# EAGLE design sumppitnodeboard (EAGLE 9.1.3)
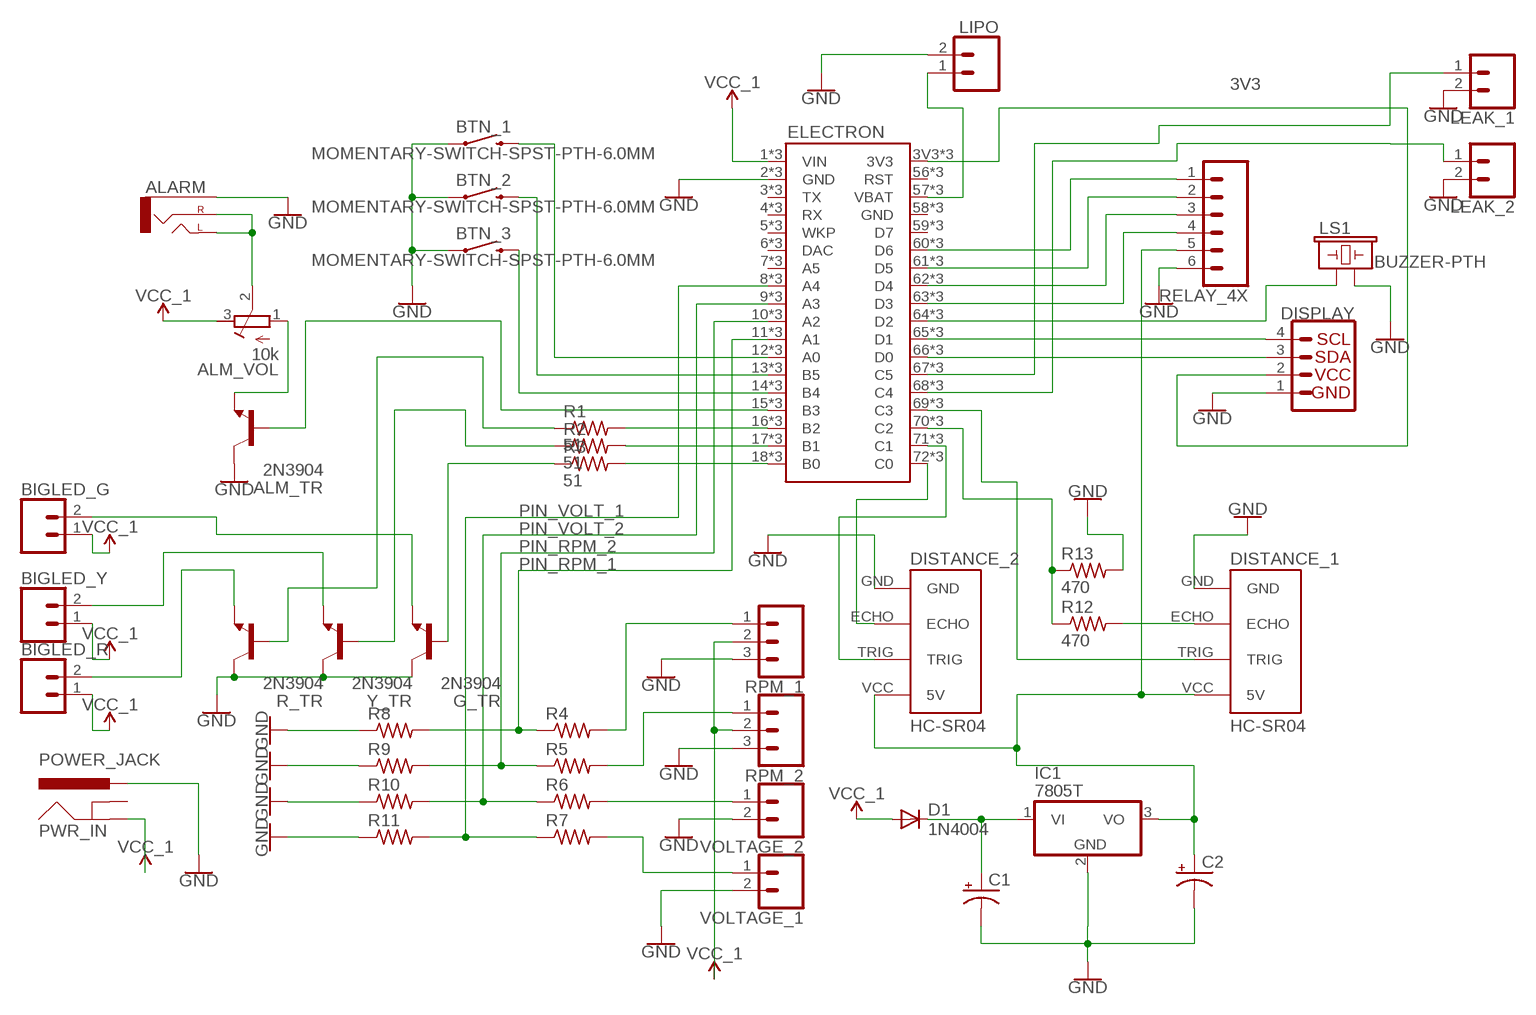
[diagram p0: schematic, sheet 1]

## Parts
ALARM  AUDIO_JACK_2.5MM_2.5MM  [STEREOJACK2.5MM_STEREOJACK2.5MM]
ALM_TR  2N3904  [TO92]
ALM_VOL  10k  R-TRIMM64W  [RTRIM64W]
BIGLED_G  CONN_02  [1X02]
BIGLED_R  CONN_02  [1X02]
BIGLED_Y  CONN_02  [1X02]
BTN_1  MOMENTARY-SWITCH-SPST-PTH-6.0MM  [TACTILE_SWITCH_PTH_6.0MM]
BTN_2  MOMENTARY-SWITCH-SPST-PTH-6.0MM  [TACTILE_SWITCH_PTH_6.0MM]
BTN_3  MOMENTARY-SWITCH-SPST-PTH-6.0MM  [TACTILE_SWITCH_PTH_6.0MM]
C1  CPOL-USE1.8-4  [E1,8-4]
C2  CPOL-USE1.8-4  [E1,8-4]
D1  1N4004  [DO41-10]
DISPLAY  I2C_STANDARD  [1X04]
DISTANCE_1  HC-SR04  [HC-SR04_FOOTPRINT]
DISTANCE_2  HC-SR04  [HC-SR04_FOOTPRINT]
ELECTRON  ELECTRONDUALROW  [ELECTRON_DUAL-ROW]
G_TR  2N3904  [TO92]
IC1  7805T  [TO220H]
LEAK_1  CONN_02  [1X02]
LEAK_2  CONN_02  [1X02]
LIPO  CONN_02JST-PTH-2  [JST-2-PTH]
LS1  BUZZER-PTH  [BUZZER-12MM]
PWR_IN  POWER_JACK  [POWER_JACK_PTH]
R1  51  R-US_0204/5  [0204/5]
R2  51  R-US_0204/5  [0204/5]
R3  51  R-US_0204/5  [0204/5]
R4  R-US_0204/5  [0204/5]
R5  R-US_0204/5  [0204/5]
R6  R-US_0204/5  [0204/5]
R7  R-US_0204/5  [0204/5]
R8  R-US_0204/5  [0204/5]
R9  R-US_0204/5  [0204/5]
R10  R-US_0204/5  [0204/5]
R11  R-US_0204/5  [0204/5]
R12  470  R-US_0204/5  [0204/5]
R13  470  R-US_0204/5  [0204/5]
R_TR  2N3904  [TO92]
RELAY_4X  CONN_06LOCK  [1X06_LOCK]
RPM_1  CONN_03  [1X03]
RPM_2  CONN_03  [1X03]
VOLTAGE_1  CONN_02  [1X02]
VOLTAGE_2  CONN_02  [1X02]
Y_TR  2N3904  [TO92]

## Nets
3V3: DISPLAY.2 ELECTRON.3V3 ELECTRON.55(3V3) ELECTRON.91(3V3)
GND: ALARM.RING1(SLEEVE) ALM_TR.1(C) BTN_1.1 BTN_2.1 BTN_3.1 C1.- C2.- DISPLAY.1 DISTANCE_1.GND DISTANCE_2.GND ELECTRON.2(GND) ELECTRON.38(GND) ELECTRON.GND@2(GND) G_TR.1(C) IC1.2(GND) LEAK_1.2 LEAK_2.2 LIPO.2 LS1.- PWR_IN.PWR R8.1 R9.1 R10.1 R11.1 R13.2 R_TR.1(C) RELAY_4X.6 RPM_1.3 RPM_2.3 VOLTAGE_1.2 VOLTAGE_2.2 Y_TR.1(C)
N$1: ALARM.SHIELD(LEFT) ALARM.TIP(RIGHT) ALM_VOL.2(S)
N$2: ALM_TR.3(E) ALM_VOL.1(A)
N$3: ALM_TR.2(B) ELECTRON.15(B3) ELECTRON.51(B3) ELECTRON.B3
N$4: R1.1 R_TR.2(B)
N$5: ELECTRON.17(B1) ELECTRON.53(B1) ELECTRON.B1 R2.2
N$6: ELECTRON.18(B0) ELECTRON.54(B0) ELECTRON.B0 R3.2
N$7: BTN_3.3 ELECTRON.14(B4) ELECTRON.50(B4) ELECTRON.B4
N$8: ELECTRON.57(VBAT) ELECTRON.93(VBAT) ELECTRON.VBAT LIPO.1
N$9: BTN_2.3 ELECTRON.13(B5) ELECTRON.49(B5) ELECTRON.B5
N$10: BTN_1.3 ELECTRON.12(A0) ELECTRON.48(A0) ELECTRON.A0
N$11: DISPLAY.3 ELECTRON.66(D0) ELECTRON.102(D0) ELECTRON.D0
N$12: DISPLAY.4 ELECTRON.65(D1) ELECTRON.101(D1) ELECTRON.D1
N$13: BIGLED_G.2 G_TR.3(E)
N$14: DISTANCE_1.ECHO R12.2
N$15: DISTANCE_2.ECHO ELECTRON.72(C0) ELECTRON.108(C0) ELECTRON.C0
N$16: DISTANCE_2.TRIG ELECTRON.71(C1) ELECTRON.107(C1) ELECTRON.C1
N$17: DISTANCE_1.TRIG ELECTRON.69(C3) ELECTRON.105(C3) ELECTRON.C3
N$18: C1.+ D1.C IC1.1(VI)
N$19: ELECTRON.16(B2) ELECTRON.52(B2) ELECTRON.B2 R1.2
N$20: R2.1 Y_TR.2(B)
N$21: G_TR.2(B) R3.1
N$22: ELECTRON.64(D2) ELECTRON.100(D2) ELECTRON.D2 LS1.+
N$23: ELECTRON.67(C5) ELECTRON.103(C5) ELECTRON.C5 LEAK_1.1
N$24: R6.2 VOLTAGE_2.1
N$25: R5.2 RPM_2.1
N$26: R4.2 RPM_1.1
N$27: R7.2 VOLTAGE_1.1
N$28: ELECTRON.70(C2) ELECTRON.106(C2) ELECTRON.C2 R12.1 R13.1
N$29: BIGLED_Y.2 Y_TR.3(E)
N$30: BIGLED_R.2 R_TR.3(E)
N$32: ELECTRON.68(C4) ELECTRON.104(C4) ELECTRON.C4 LEAK_2.1
N$33: C2.+ DISTANCE_1.VCC(5V) DISTANCE_2.VCC(5V) IC1.3(VO) RELAY_4X.5
N$34: ELECTRON.63(D3) ELECTRON.99(D3) ELECTRON.D3 RELAY_4X.4
N$35: ELECTRON.62(D4) ELECTRON.98(D4) ELECTRON.D4 RELAY_4X.3
N$36: ELECTRON.61(D5) ELECTRON.97(D5) ELECTRON.D5 RELAY_4X.2
N$37: ELECTRON.60(D6) ELECTRON.96(D6) ELECTRON.D6 RELAY_4X.1
PIN_RPM_1: ELECTRON.11(A1) ELECTRON.47(A1) ELECTRON.A1 R4.1 R8.2
PIN_RPM_2: ELECTRON.10(A2) ELECTRON.46(A2) ELECTRON.A2 R5.1 R9.2
PIN_VOLT_1: ELECTRON.8(A4) ELECTRON.44(A4) ELECTRON.A4 R7.1 R11.2
PIN_VOLT_2: ELECTRON.9(A3) ELECTRON.45(A3) ELECTRON.A3 R6.1 R10.2
VCC_1: ALM_VOL.3(E) BIGLED_G.1 BIGLED_R.1 BIGLED_Y.1 D1.A ELECTRON.1(VIN) ELECTRON.37(VIN) ELECTRON.VIN PWR_IN.GND RPM_1.2 RPM_2.2
Unconnected: ELECTRON.3(TX) ELECTRON.4(RX) ELECTRON.5(WKP) ELECTRON.6(DAC) ELECTRON.7(A5) ELECTRON.39(TX) ELECTRON.40(RX) ELECTRON.41(WKP) ELECTRON.42(DAC) ELECTRON.43(A5) ELECTRON.56(RST) ELECTRON.59(D7) ELECTRON.92(RST) ELECTRON.95(D7) ELECTRON.A5 ELECTRON.D7 ELECTRON.DAC ELECTRON.RST ELECTRON.RX ELECTRON.TX ELECTRON.WKP PWR_IN.GNDBREAK

## Power pins joined to a net without a drawn wire
GND: ELECTRON.58(GND) ELECTRON.94(GND) ELECTRON.GND

## Library data of the parts
ALARM = SparkFun-Connectors:AUDIO_JACK_2.5MM: Audio Jack 2.5mm variants of PTH and SMT audio jacks. SparkFun Products: SparkFun PicoBoard <https://www.sparkfun.com/products/11888>- 2.5mm SMD; PROD_ID: CONN-09878
ALM_TR G_TR R_TR Y_TR = transistor:2N3904: NPN TRANSISTOR
ALM_VOL = rcl:R-TRIMM: Trimm resistor; SPICEMODEL: X; SPICEPREFIXL: POT
BIGLED_G BIGLED_R BIGLED_Y LEAK_1 LEAK_2 VOLTAGE_1 VOLTAGE_2 = SparkFun-Connectors:CONN_02: Multi connection point. Often used as Generic Header-pin footprint for 0.1 inch spaced/style header connections On any of the 0.1 inch spaced packages, you can populate with these: Break Away Headers - Straight <https://www.sparkfun.com/products/116> (PRT-00116) Break Away Male Headers - Right Angle <https://www.sparkfun.com/products/553> (PRT-00553) Female Headers <https://www.sparkfun.com/products/115> (PRT-00115) Break Away Headers - Machine Pin <https://www.sparkfun.com/products/117> (PRT-00117) Break Away Female Headers - Swiss Machine Pin <https://www.sparkfun.com/products/743> (PRT-00743) For SCREWTERMINALS and SPRING TERMINALS visit here: Screw Terimnals on SparkFun.com <https://www.sparkfun.com/search/results?term=Screw+Terminals> (5mm/3.5mm/2.54mm spacing) This device is also useful as a general connection point to wire up your design to another part of your project. Our various solder wires solder well into these plated through hole pads. Hook-Up Wire - Assortment (Stranded, 22 AWG) <https://www.sparkfun.com/products/11375> (PRT-11375) Hook-Up Wire - Assortment (Solid Core, 22 AWG) <https://www.sparkfun.com/products/11367> (PRT-11367) View the entire wire category on our website here <https://www.sparkfun.com/categories/141> Special notes: Molex polarized connector foot print use with: PRT-08233 with associated crimp pins and housings. 2.54_SCREWTERM for use with PRT-10571. 3.5mm Screw Terminal footprints for PRT-08084 5mm Screw Terminal footprints for use with PRT-08432
BTN_1-BTN_3 = SparkFun-Switches:MOMENTARY-SWITCH-SPST: Momentary Switch (Pushbutton) - SPST Normally-open (NO) SPST momentary switches (buttons, pushbuttons). Variants PTH-12MM - 12mm square, through-hole Momentary Pushbutton Switch - 12mm Square <https://www.sparkfun.com/products/9190> (COM-09190) PTH-6.0MM, PTH-6.0MM-KIT - 6.0mm square, through-hole Mini Pushbutton Switch <https://www.sparkfun.com/products/97> (COM-00097) KIT package intended for soldering kit's - only one side of pads' copper is exposed. PTH-RIGHT-ANGLE-KIT - Right-angle, through-hole Right Angle Tactile Button <https://www.sparkfun.com/products/10791> - Used on SparkFun BigTime Watch Kit <https://www.sparkfun.com/products/11734> SMD-12MM - 12mm square, surface-mount Tactile Button - SMD (12mm) <https://www.sparkfun.com/products/12993> (COM-12993) Used on SparkFun PicoBoard <https://www.sparkfun.com/products/11888> SMD-4.5MM - 4.5mm Square Trackball Switch Used on SparkFun Blackberry Trackballer Breakout <https://www.sparkfun.com/products/13169> SMD-4.6MMX2.8MM - 4.60mm x 2.80mm, surface mount Used on SparkFun SAMD21 Mini Breakout <https://www.sparkfun.com/products/13664> SMD-5.2MM, SMD-5.2-REDUNDANT - 5.2mm square, surface-mount Mini Pushbutton Switch - SMD <https://www.sparkfun.com/products/8720> (COM-08720) Used on Arduino Pro Mini <https://www.sparkfun.com/products/11114> REDUNDANT package connects both switch circuits together SMD-6.0X3.5MM - 6.0 x 3.5mm, surface mount Momentary Reset Switch SMD <https://www.sparkfun.com/products/8229> (COM-08229) SMD-6.2MM-TALL - 6.2mm square, surface mount Tactile Button - SMD (6mm) <https://www.sparkfun.com/products/12992> Used on SparkFun Digital Sandbox <https://www.sparkfun.com/products/12651> SMD-RIGHT-ANGLE - Right-angle, surface mount Used on SparkFun Block for Intel® Edison - Arduino <https://www.sparkfun.com/products/13036>; PROD_ID: SWCH-08441; SF_SKU: COM-00097
C1 C2 = rcl:CPOL-US: POLARIZED CAPACITOR, American symbol; SPICEPREFIX: C
D1 = diode:1N4004: DIODE general purpose rectifier, 1 A
DISPLAY = SparkFun-Connectors:I2C_STANDARD: SparkFun I2C Standard Pinout Header SparkFun has standardized on a pinout for all I2C based sensor breakouts. This pinout allows I2C boards to be plugged directly into the headers on Arduino Uno compatible boards, and to be daisy chained easily. Example SparkFun Products: SparkFun Atmospheric Sensor Breakout - BME280 <https://www.sparkfun.com/products/13676> SparkFun Altitude/Pressure Sensor Breakout - MPL3115A2 <https://www.sparkfun.com/products/11084> SparkFun TOF Range Finder Sensor - VL6180 <https://www.sparkfun.com/products/12785>
DISTANCE_1 DISTANCE_2 = Ultrasonic Sensor HC-SR04:HC-SR04: Ultrasonic Sensor HC-SR04
ELECTRON = Particle:ELECTRON
IC1 = linear:78*: Positive VOLTAGE REGULATOR Source: http://cache.national.com/ds/LM/LM78L05.pdf http://www.fairchildsemi.com/ds/LM/LM7805.pdf
LIPO = SparkFun-Connectors:CONN_02: Multi connection point. Often used as Generic Header-pin footprint for 0.1 inch spaced/style header connections On any of the 0.1 inch spaced packages, you can populate with these: Break Away Headers - Straight <https://www.sparkfun.com/products/116> (PRT-00116) Break Away Male Headers - Right Angle <https://www.sparkfun.com/products/553> (PRT-00553) Female Headers <https://www.sparkfun.com/products/115> (PRT-00115) Break Away Headers - Machine Pin <https://www.sparkfun.com/products/117> (PRT-00117) Break Away Female Headers - Swiss Machine Pin <https://www.sparkfun.com/products/743> (PRT-00743) For SCREWTERMINALS and SPRING TERMINALS visit here: Screw Terimnals on SparkFun.com <https://www.sparkfun.com/search/results?term=Screw+Terminals> (5mm/3.5mm/2.54mm spacing) This device is also useful as a general connection point to wire up your design to another part of your project. Our various solder wires solder well into these plated through hole pads. Hook-Up Wire - Assortment (Stranded, 22 AWG) <https://www.sparkfun.com/products/11375> (PRT-11375) Hook-Up Wire - Assortment (Solid Core, 22 AWG) <https://www.sparkfun.com/products/11367> (PRT-11367) View the entire wire category on our website here <https://www.sparkfun.com/categories/141> Special notes: Molex polarized connector foot print use with: PRT-08233 with associated crimp pins and housings. 2.54_SCREWTERM for use with PRT-10571. 3.5mm Screw Terminal footprints for PRT-08084 5mm Screw Terminal footprints for use with PRT-08432; PROD_ID: CONN-09863; SKU: PRT-09914
LS1 = SparkFun-Electromechanical:BUZZER: Buzzer Small round buzzers that operate around the audible 2kHz range. You can use these as speakers to create simple music or user interfaces. Variant Overview: PTH - Mini Speaker - PC Mount 12mm 2.048kHz <https://www.sparkfun.com/products/7950> PTH_KIT - Mini Speaker - PC Mount 12mm 2.048kHz <https://www.sparkfun.com/products/7950> KIT simplifies soldering by adding stop mask to one side of the pads. PTH_NO_SILK - Mini Speaker - PC Mount 12mm 2.048kHz <https://www.sparkfun.com/products/7950> No silkscreen indicator of buzzer outline. PTH_KIT_NO_SILK - Mini Speaker - PC Mount 12mm 2.048kHz <https://www.sparkfun.com/products/7950> KIT package w/o silkscreen SMD - Buzzer Audio Magnetic (CCV-084B16) SMD buzzer used on, e.g. the LilyPad Buzzer <https://www.sparkfun.com/products/8463> and RFID USB Reader <https://www.sparkfun.com/products/9963>. SMD_KIT - Buzzer Audio Magnetic (CCV-084B16) SMD Buzzer with elongated pins to make soldering easier. Used on the SparkFun Simon Says - Surface Mount Soldering Kit <https://www.sparkfun.com/products/10935>.; PROD_ID: COMP-08253; SF_SKU: COM-07950
PWR_IN = SparkFun-Connectors:POWER_JACK: Power Jack Connector This is the standard 5.5mm barrel jack for power. The PTH is the most common, proven, reliable, footprint. The Slot footprint only works if the mill layer is transmitted to the PCB fab house so be warned. Here are the connectors we sell at SparkFun: DC Barrel Power Jack/Connector <https://www.sparkfun.com/products/119> (PRT-00119) DC Barrel Power Jack/Connector (SMD) <https://www.sparkfun.com/products/12748> (PRT-12748) DC Barrel Jack Adapter - Breadboard Compatible <https://www.sparkfun.com/products/10811> (PRT-10811) It is used on this SparkFun product (and many, many others): SparkFun RedBoard - Programmed with Arduino <https://www.sparkfun.com/products/12757> (DEV-12757) Also, if you need a mating power supply or connector, please check these out: Wall Adapter Power Supply - 9VDC 650mA <https://www.sparkfun.com/products/298> (TOL-00298) DC Barrel Jack Adapter - Male <https://www.sparkfun.com/products/10287> (PRT-10287); PROD_ID: CONN-08197
R1-R13 = resistor:R-US_: RESISTOR, American symbol
RELAY_4X = SparkFun-Connectors:CONN_06: Multi connection point. Often used as Generic Header-pin footprint for 0.1 inch spaced/style header connections On any of the 0.1 inch spaced packages, you can populate with these: Break Away Headers - Straight <https://www.sparkfun.com/products/116> (PRT-00116) Break Away Male Headers - Right Angle <https://www.sparkfun.com/products/553> (PRT-00553) Female Headers <https://www.sparkfun.com/products/115> (PRT-00115) Break Away Headers - Machine Pin <https://www.sparkfun.com/products/117> (PRT-00117) Break Away Female Headers - Swiss Machine Pin <https://www.sparkfun.com/products/743> (PRT-00743) Arduino Stackable Header - 6 Pin <https://www.sparkfun.com/products/9280> (PRT-09280) For SCREWTERMINALS and SPRING TERMINALS visit here: Screw Terimnals on SparkFun.com <https://www.sparkfun.com/search/results?term=Screw+Terminals> (5mm/3.5mm/2.54mm spacing) This device is also useful as a general connection point to wire up your design to another part of your project. Our various solder wires solder well into these plated through hole pads. Hook-Up Wire - Assortment (Stranded, 22 AWG) <https://www.sparkfun.com/products/11375> (PRT-11375) Hook-Up Wire - Assortment (Solid Core, 22 AWG) <https://www.sparkfun.com/products/11367> (PRT-11367) View the entire wire category on our website here <https://www.sparkfun.com/categories/141>
RPM_1 RPM_2 = SparkFun-Connectors:CONN_03: Multi connection point. Often used as Generic Header-pin footprint for 0.1 inch spaced/style header connections On any of the 0.1 inch spaced packages, you can populate with these: Break Away Headers - Straight <https://www.sparkfun.com/products/116> (PRT-00116) Break Away Male Headers - Right Angle <https://www.sparkfun.com/products/553> (PRT-00553) Female Headers <https://www.sparkfun.com/products/115> (PRT-00115) Break Away Headers - Machine Pin <https://www.sparkfun.com/products/117> (PRT-00117) Break Away Female Headers - Swiss Machine Pin <https://www.sparkfun.com/products/743> (PRT-00743) Stackable Header - 3 Pin (Female, 0.1") <https://www.sparkfun.com/products/13875> (PRT-13875) For SCREWTERMINALS and SPRING TERMINALS visit here: Screw Terimnals on SparkFun.com <https://www.sparkfun.com/search/results?term=Screw+Terminals> (5mm/3.5mm/2.54mm spacing) This device is also useful as a general connection point to wire up your design to another part of your project. Our various solder wires solder well into these plated through hole pads. Hook-Up Wire - Assortment (Stranded, 22 AWG) <https://www.sparkfun.com/products/11375> (PRT-11375) Hook-Up Wire - Assortment (Solid Core, 22 AWG) <https://www.sparkfun.com/products/11367> (PRT-11367) View the entire wire category on our website here <https://www.sparkfun.com/categories/141> Special notes: Molex polarized connector foot print use with SKU : PRT-08232 with associated crimp pins and housings.

## Board
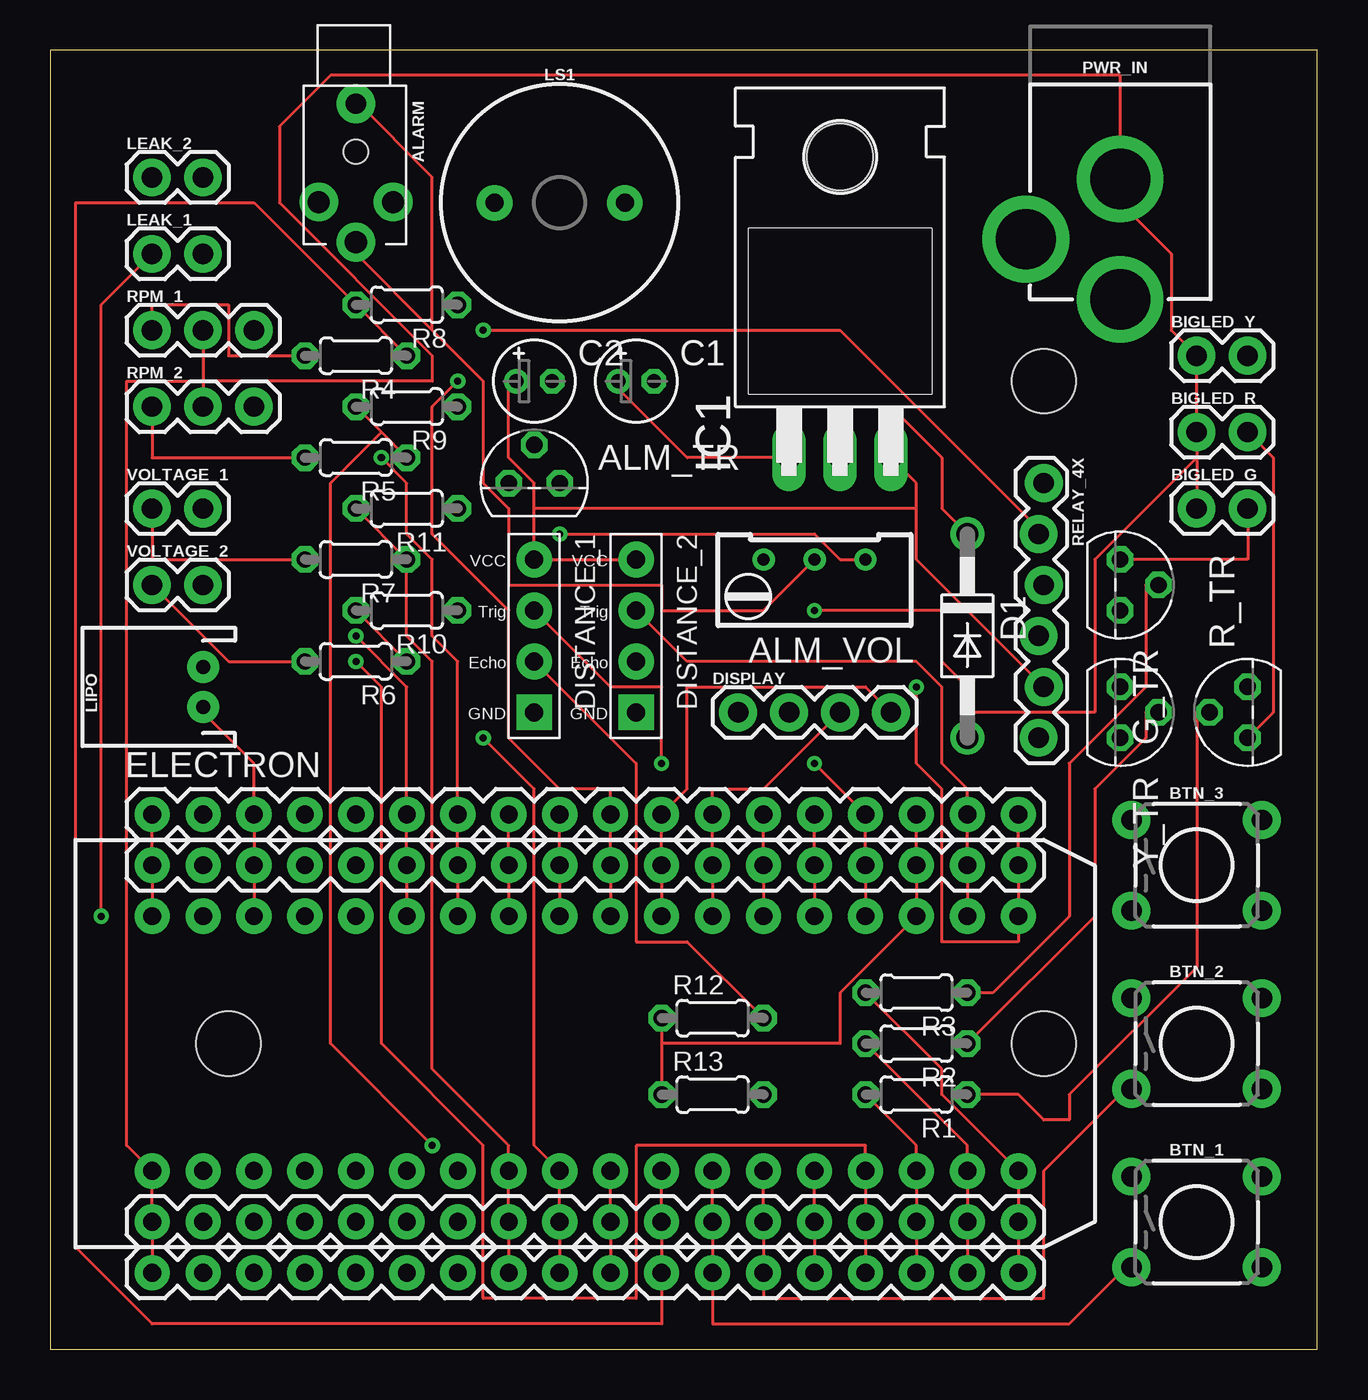
[diagram p1: board, top side]
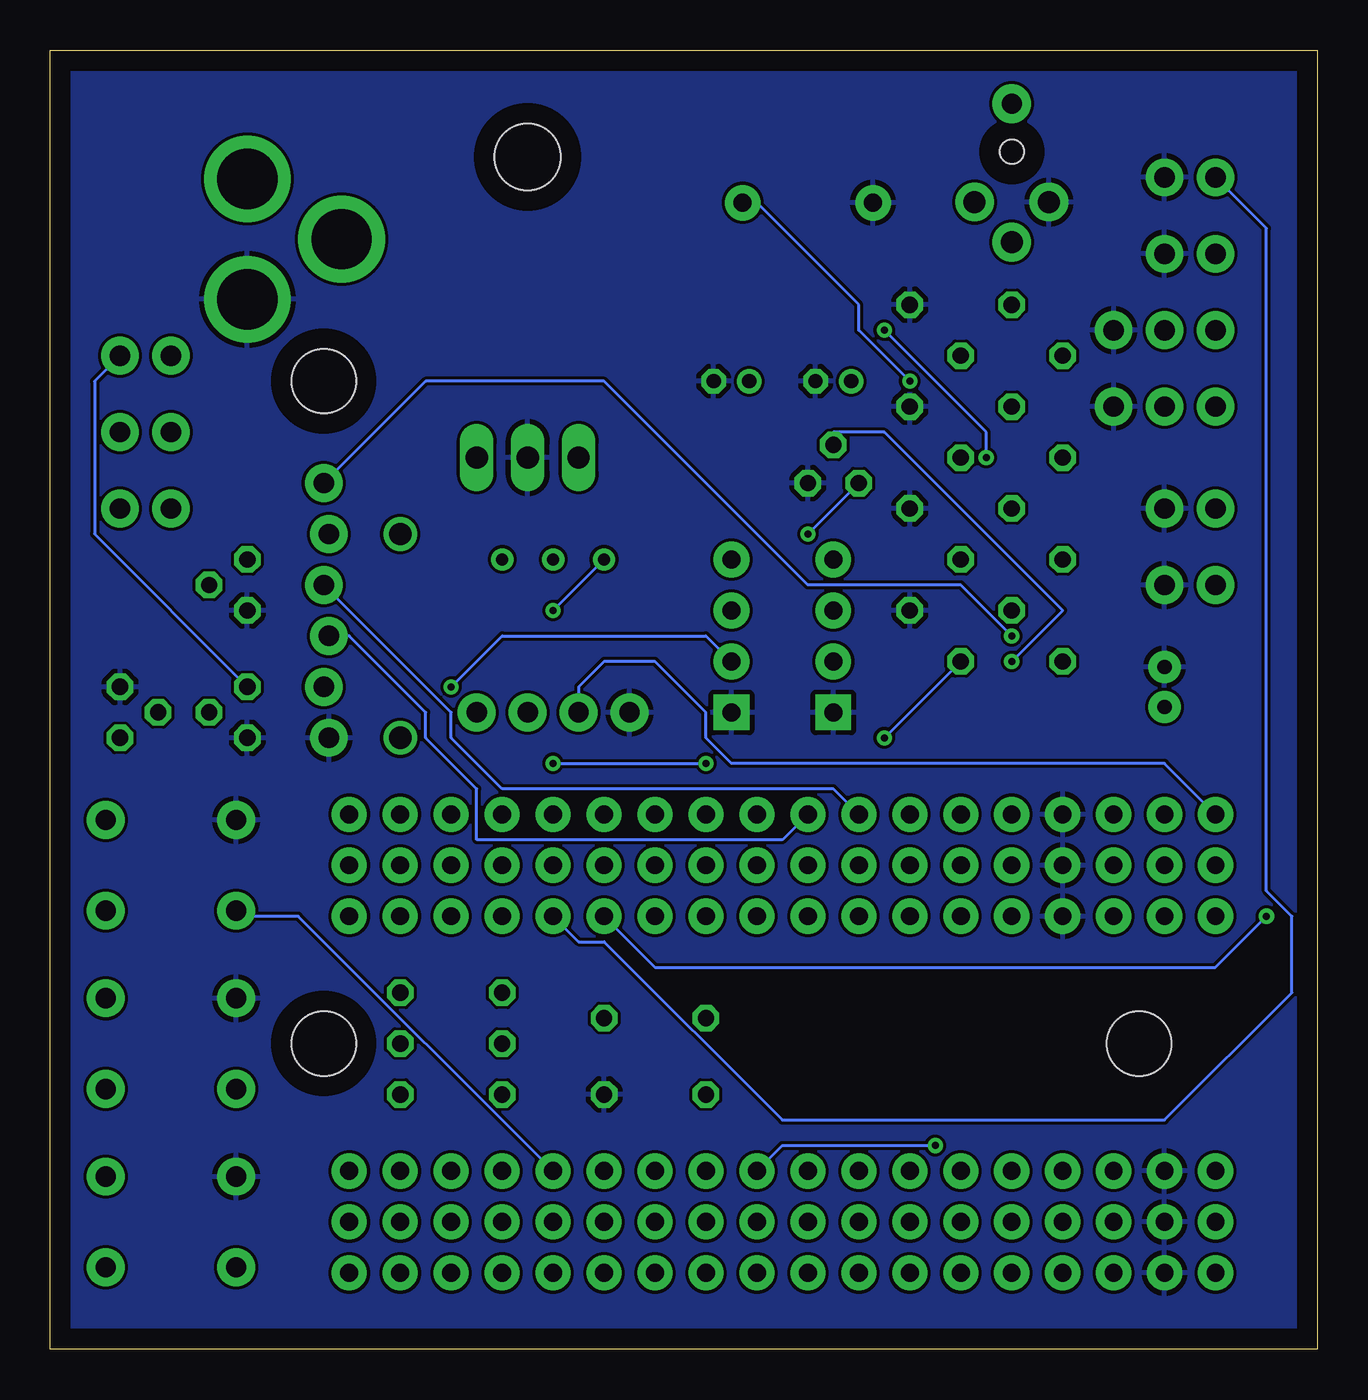
[diagram p2: board, bottom side, seen from below]

Size 63.17 x 64.76 mm. Coordinates in mm from the lower left corner, seen from the top.
Outline: 0,0 63.17,0 63.17,64.76 0,64.76 0,0
Copper layers (1*16): Top 0.035mm / dielectric 1.5mm / Bottom 0.035mm
Design rules "default": minimum track width 6mil, minimum drill 0.35mm, track to track 6mil, track to pad 6mil, pad to pad 6mil, via to via 6mil, smd to smd 6mil, copper to edge 40mil, drill to drill 6mil, minimum pad ring 10mil, minimum via ring 8mil, stop-mask expansion 4mil, vias tented up to drill 0mil, thermal gap 10mil
Holes 3.2 mm at 8.89,15.24 49.53,48.26 49.53,15.24

### Footprints (pad centres in the part's own frame; a part is rotated, then mirrored left to right if it is on the bottom)
STEREOJACK2.5MM_STEREOJACK2.5MM = drill 1.1 pad 1.93: RING1 2.5,-1.85; RING2 2.5,1.85; TIP 4.5,0 | drill 1 pad 1.93: SHIELD -2.4,0 | hole 1.2: 0,0
TO92 = drill 0.813 octagon: 1 1.27,0; 2 0,1.905; 3 -1.27,0
RTRIM64W = drill 0.61: 1 1.27,-2.54; 2 1.27,0; 3 1.27,2.54
1X02 = drill 1.016 pad 1.88: 1 0,0; 2 2.54,0
TACTILE_SWITCH_PTH_6.0MM = drill 1.016 pad 1.88: 1 -3.251,2.261; 2 3.251,2.261; 3 -3.251,-2.261; 4 3.251,-2.261
E1,8-4 = drill 0.711 pad 1.168: + -0.889,0 | drill 0.711 pad 1.168 octagon: - 0.889,0
DO41-10 = drill 1.118: A 5.08,0; C -5.08,0
1X04 = drill 1.016 pad 1.88: 1 0,0; 2 2.54,0; 3 5.08,0; 4 7.62,0
HC-SR04_FOOTPRINT = drill 0.9 pad 1.778: ECHO 0,1.27; TRIG 0,-1.27; VCC 0,-3.81 | drill 0.9 pad 1.778 square: GND 0,3.81
ELECTRON_DUAL-ROW = drill 0.889 pad 1.753: 1 1.27,2.54; 2 3.81,2.54; 3 6.35,2.54; 3V3 1.27,22.86; 4 8.89,2.54; 5 11.43,2.54; 6 13.97,2.54; 7 16.51,2.54; 8 19.05,2.54; 9 21.59,2.54; 10 24.13,2.54; 11 26.67,2.54; 12 29.21,2.54; 13 31.75,2.54; 14 34.29,2.54; 15 36.83,2.54; 16 39.37,2.54; 17 41.91,2.54; 18 44.45,2.54; 37 1.27,7.62; 38 3.81,7.62; 39 6.35,7.62; 40 8.89,7.62; 41 11.43,7.62; 42 13.97,7.62; 43 16.51,7.62; 44 19.05,7.62; 45 21.59,7.62; 46 24.13,7.62; 47 26.67,7.62; 48 29.21,7.62; 49 31.75,7.62; 50 34.29,7.62; 51 36.83,7.62; 52 39.37,7.62; 53 41.91,7.62; 54 44.45,7.62; 55 1.27,20.32; 56 3.81,20.32; 57 6.35,20.32; 58 8.89,20.32; 59 11.43,20.32; 60 13.97,20.32; 61 16.51,20.32; 62 19.05,20.32; 63 21.59,20.32; 64 24.13,20.32; 65 26.67,20.32; 66 29.21,20.32; 67 31.75,20.32; 68 34.29,20.32; 69 36.83,20.32; 70 39.37,20.32; 71 41.91,20.32; 72 44.45,20.32; 91 1.27,25.4; 92 3.81,25.4; 93 6.35,25.4; 94 8.89,25.4; 95 11.43,25.4; 96 13.97,25.4; 97 16.51,25.4; 98 19.05,25.4; 99 21.59,25.4; 100 24.13,25.4; 101 26.67,25.4; 102 29.21,25.4; 103 31.75,25.4; 104 34.29,25.4; 105 36.83,25.4; 106 39.37,25.4; 107 41.91,25.4; 108 44.45,25.4; A0 29.21,5.08; A1 26.67,5.08; A2 24.13,5.08; A3 21.59,5.08; A4 19.05,5.08; A5 16.51,5.08; B0 44.45,5.08; B1 41.91,5.08; B2 39.37,5.08; B3 36.83,5.08; B4 34.29,5.08; B5 31.75,5.08; C0 44.45,22.86; C1 41.91,22.86; C2 39.37,22.86; C3 36.83,22.86; C4 34.29,22.86; C5 31.75,22.86; D0 29.21,22.86; D1 26.67,22.86; D2 24.13,22.86; D3 21.59,22.86; D4 19.05,22.86; D5 16.51,22.86; D6 13.97,22.86; D7 11.43,22.86; DAC 13.97,5.08; GND 8.89,22.86; GND@2 3.81,5.08; RST 3.81,22.86; RX 8.89,5.08; TX 6.35,5.08; VBAT 6.35,22.86; VIN 1.27,5.08; WKP 11.43,5.08
TO220H = drill 1.118 long: 1 -2.54,-10.16; 2 0,-10.16; 3 2.54,-10.16 | hole 3.302: 0,4.826
JST-2-PTH = drill 0.7 pad 1.6: 1 -1,0; 2 1,0
BUZZER-12MM = drill 0.9 pad 1.778: + 3.25,0; - -3.25,0
POWER_JACK_PTH = drill 2.997 pad 4.318: GND 0,7.7; GNDBREAK 4.7,10.7; PWR 0,13.7
0204/5 = drill 0.813 octagon: 1 -2.54,0; 2 2.54,0
1X06_LOCK = drill 1.016 pad 1.88: 1 0,0; 2 2.54,-0.254; 3 5.08,0; 4 7.62,-0.254; 5 10.16,0; 6 12.7,-0.254
1X03 = drill 1.016 pad 1.88: 1 0,0; 2 2.54,0; 3 5.08,0

### Placement (x,y rotation side)
ALARM  15.24,59.69 270 top
ALM_TR  24.13,43.18 0 top
ALM_VOL  38.1,38.1 90 top
BIGLED_G  57.15,41.91 0 top
BIGLED_R  57.15,45.72 0 top
BIGLED_Y  57.15,49.53 0 top
BTN_1  57.15,6.35 0 top
BTN_2  57.15,15.24 0 top
BTN_3  57.15,24.13 0 top
C1  29.21,48.26 0 top
C2  24.13,48.26 0 top
D1  45.72,35.56 270 top
DISPLAY  34.29,31.75 0 top
DISTANCE_1  24.13,35.56 180 top
DISTANCE_2  29.21,35.56 180 top
ELECTRON  3.81,1.27 0 top
G_TR  53.34,38.1 270 top
IC1  39.37,54.61 0 top
LEAK_1  5.08,54.61 0 top
LEAK_2  5.08,58.42 0 top
LIPO  7.62,33.02 90 top
LS1  25.4,57.15 0 top
PWR_IN  53.34,66.04 180 top
R1  43.18,12.7 180 top
R2  43.18,15.24 180 top
R3  43.18,17.78 180 top
R4  15.24,49.53 180 top
R5  15.24,44.45 180 top
R6  15.24,34.29 180 top
R7  15.24,39.37 180 top
R8  17.78,52.07 180 top
R9  17.78,46.99 180 top
R10  17.78,36.83 180 top
R11  17.78,41.91 180 top
R12  33.02,16.51 0 top
R13  33.02,12.7 0 top
R_TR  59.69,31.75 90 top
RELAY_4X  49.53,43.18 270 top
RPM_1  5.08,50.8 0 top
RPM_2  5.08,46.99 0 top
VOLTAGE_1  5.08,41.91 0 top
VOLTAGE_2  5.08,38.1 0 top
Y_TR  53.34,31.75 270 top

### Tracks (layer width: path | path; a pad name or v marks a point on that pad's centre or on a via)
3V3
  Top 0.152: ELECTRON.55 ELECTRON.3V3 ELECTRON.91
  Bottom 0.152: DISPLAY.2 36.83,33.02 35.56,34.29 33.02,34.29 30.48,31.75 30.48,30.48 29.21,29.21 7.62,29.21 ELECTRON.91
GND
  pour Bottom: 0,64.77 0,0 63.5,0 63.5,64.77
N$1
  Top 0.152: ALM_VOL.2 35.56,36.83 30.48,36.83 30.48,38.1 22.86,38.1 22.86,41.91 21.59,43.18 21.59,48.26 19.05,50.8 | 19.05,50.8 15.24,54.61 ALARM.TIP | 19.05,50.8 19.05,58.42 15.24,62.23 ALARM.SHIELD
N$2  (via drill 0.35)
  Top 0.152: ALM_VOL.1 39.37,39.37 38.1,40.64 v25.4,40.64
  Bottom 0.152: ALM_TR.3 v25.4,40.64
N$3  (via drill 0.35)
  Top 0.152: ELECTRON.15 ELECTRON.B3 ELECTRON.51 40.64,10.16 29.21,10.16 29.21,2.54 21.59,2.54 21.59,10.16 16.51,15.24 16.51,33.02 v15.24,34.29
  Bottom 0.152: v15.24,34.29 12.7,36.83 21.59,45.72 24.13,45.72 ALM_TR.2
N$4
  Top 0.152: R1.1 48.26,12.7 49.53,11.43 50.8,11.43 50.8,12.7 57.15,19.05 57.15,31.75 R_TR.2
N$5
  Top 0.152: ELECTRON.17 ELECTRON.B1 ELECTRON.53 45.72,10.16 R2.2
N$6
  Top 0.152: ELECTRON.18 ELECTRON.B0 ELECTRON.54 44.45,12.7 44.45,13.97 R3.2
N$7
  Top 0.152: ELECTRON.14 ELECTRON.B4 ELECTRON.50
  Bottom 0.152: ELECTRON.50 50.8,21.59 53.34,21.59 BTN_3.3
N$8
  Top 0.152: ELECTRON.57 ELECTRON.VBAT ELECTRON.93 10.16,29.21 7.62,31.75 LIPO.1
N$9
  Top 0.152: ELECTRON.49 ELECTRON.B5 ELECTRON.13 35.56,2.54 49.53,2.54 49.53,8.89 53.34,12.7 BTN_2.3
N$10
  Top 0.152: ELECTRON.48 ELECTRON.A0 ELECTRON.12 33.02,1.27 50.8,1.27 53.34,3.81 BTN_1.3
N$11
  Top 0.152: ELECTRON.66 ELECTRON.D0 ELECTRON.102 33.02,27.94 35.56,27.94 DISPLAY.3
N$12
  Top 0.152: ELECTRON.65 ELECTRON.D1 ELECTRON.101 31.75,27.94 31.75,33.02 40.64,33.02 DISPLAY.4
N$13
  Top 0.152: G_TR.3 59.69,39.37 BIGLED_G.2
N$14
  Top 0.152: R12.2 31.75,20.32 29.21,20.32 29.21,29.21 DISTANCE_1.ECHO
N$15  (via drill 0.35)
  Top 0.152: ELECTRON.108 ELECTRON.C0 ELECTRON.72 48.26,20.32 44.45,20.32 44.45,27.94 43.18,29.21 v43.18,33.02
  Bottom 0.152: DISTANCE_2.ECHO 30.48,35.56 40.64,35.56 v43.18,33.02
N$16
  Top 0.152: ELECTRON.71 ELECTRON.C1 ELECTRON.107 45.72,27.94 44.45,29.21 44.45,33.02 43.18,34.29 31.75,34.29 DISTANCE_2.TRIG
N$17  (via drill 0.35)
  Top 0.152: ELECTRON.69 ELECTRON.C3 ELECTRON.105 v38.1,29.21 | DISTANCE_1.TRIG 27.94,33.02 30.48,33.02 v30.48,29.21
  Bottom 0.152: v38.1,29.21 v30.48,29.21
N$18
  Top 0.152: C1.+ 27.94,48.26 31.75,44.45 IC1.1 36.83,46.99 41.91,46.99 44.45,44.45 44.45,41.91 D1.C
N$19
  Top 0.152: ELECTRON.16 ELECTRON.B2 ELECTRON.52 43.18,10.16 R1.2
N$20
  Top 0.152: R2.1 52.07,21.59 52.07,27.94 54.61,30.48 54.61,31.75 Y_TR.2
N$21
  Top 0.152: R3.1 46.99,17.78 50.8,21.59 50.8,29.21 54.61,33.02 54.61,38.1 G_TR.2
N$22  (via drill 0.35)
  Top 0.152: ELECTRON.64 ELECTRON.D2 ELECTRON.100 27.94,27.94 25.4,27.94 22.86,30.48 22.86,36.83 19.05,40.64 19.05,46.99 v20.32,48.26
  Bottom 0.152: v20.32,48.26 22.86,50.8 22.86,52.07 27.94,57.15 LS1.+
N$23  (via drill 0.35)
  Top 0.152: ELECTRON.67 ELECTRON.C5 ELECTRON.103 | LEAK_1.1 2.54,52.07 v2.54,21.59
  Bottom 0.152: v2.54,21.59 5.08,19.05 33.02,19.05 ELECTRON.67
N$24
  Top 0.152: R6.2 8.89,34.29 VOLTAGE_2.1
N$25
  Top 0.152: R5.2 5.08,44.45 RPM_2.1
N$26
  Top 0.152: R4.2 8.89,49.53 8.89,52.07 5.08,52.07 RPM_1.1
N$27
  Top 0.152: R7.2 5.08,39.37 VOLTAGE_1.1
N$28
  Top 0.152: R12.1 30.48,15.24 | 30.48,15.24 R13.1 | ELECTRON.106 ELECTRON.C2 ELECTRON.70 39.37,17.78 39.37,15.24 30.48,15.24
N$29
  Bottom 0.152: Y_TR.3 60.96,40.64 60.96,48.26 BIGLED_Y.2
N$30
  Top 0.152: R_TR.3 60.96,31.75 60.96,44.45 BIGLED_R.2
N$32
  Top 0.152: ELECTRON.68 ELECTRON.C4 ELECTRON.104
  Bottom 0.152: LEAK_2.1 2.54,55.88 2.54,22.86 1.27,21.59 1.27,17.78 7.62,11.43 26.67,11.43 35.56,20.32 36.83,20.32 ELECTRON.68
N$33
  Top 0.152: 24.13,41.91 DISTANCE_1.VCC DISTANCE_2.VCC | 24.13,41.91 24.13,43.18 22.86,44.45 22.86,48.26 C2.+ | IC1.3 43.18,43.18 43.18,41.91 | 43.18,41.91 43.18,39.37 RELAY_4X.5 | 43.18,41.91 24.13,41.91
N$34
  Top 0.152: ELECTRON.63 ELECTRON.D3 ELECTRON.99
  Bottom 0.152: RELAY_4X.4 48.26,35.56 44.45,31.75 44.45,30.48 41.91,27.94 41.91,25.4 26.67,25.4 ELECTRON.99 | RELAY_4X.4 49.53,35.56 RELAY_4X.4
N$35
  Top 0.152: ELECTRON.62 ELECTRON.D4 ELECTRON.98
  Bottom 0.152: RELAY_4X.3 43.18,31.75 43.18,30.48 40.64,27.94 24.13,27.94 ELECTRON.98
N$36  (via drill 0.35)
  Top 0.152: ELECTRON.61 ELECTRON.D5 ELECTRON.97 20.32,34.29 19.05,35.56 19.05,39.37 17.78,40.64 17.78,43.18 v16.51,44.45 | v21.59,50.8 39.37,50.8 49.53,40.64 RELAY_4X.2
  Bottom 0.152: v21.59,50.8 16.51,45.72 v16.51,44.45
N$37  (via drill 0.35)
  Top 0.152: ELECTRON.60 ELECTRON.D6 ELECTRON.96 17.78,33.02 v15.24,35.56
  Bottom 0.152: RELAY_4X.1 44.45,48.26 35.56,48.26 25.4,38.1 17.78,38.1 v15.24,35.56
PIN_RPM_1
  Top 0.152: R4.1 R8.2 10.16,57.15 1.27,57.15 1.27,5.08 5.08,1.27 30.48,1.27 ELECTRON.11 ELECTRON.A1 ELECTRON.47
PIN_RPM_2  (via drill 0.35)
  Top 0.152: R5.1 16.51,45.72 | 16.51,45.72 R9.2 | ELECTRON.10 ELECTRON.A2 ELECTRON.46 | 16.51,45.72 13.97,43.18 13.97,15.24 v19.05,10.16
  Bottom 0.152: v19.05,10.16 26.67,10.16 ELECTRON.46
PIN_VOLT_1
  Top 0.152: R11.2 R7.1 17.78,35.56 19.05,34.29 19.05,13.97 22.86,10.16 ELECTRON.44 ELECTRON.A4 ELECTRON.8
PIN_VOLT_2  (via drill 0.35)
  Top 0.152: R6.1 R10.2 | ELECTRON.9 ELECTRON.A3 ELECTRON.45 24.13,10.16 24.13,27.94 v21.59,30.48
  Bottom 0.152: v21.59,30.48 R6.1
VCC_1  (via drill 0.35)
  Top 0.152: RPM_1.2 7.62,48.26 | 7.62,48.26 RPM_2.2 | ELECTRON.1 ELECTRON.VIN ELECTRON.37 3.81,10.16 3.81,48.26 7.62,48.26 | v38.1,36.83 44.45,36.83 44.45,34.29 45.72,33.02 45.72,31.75 | D1.A 45.72,31.75 | 57.15,44.45 BIGLED_R.1 BIGLED_Y.1 55.88,50.8 55.88,54.61 53.34,57.15 PWR_IN.GND 53.34,58.42 53.34,63.5 13.97,63.5 11.43,60.96 11.43,57.15 19.05,49.53 19.05,48.26 7.62,48.26 | 57.15,44.45 BIGLED_G.1 | 45.72,31.75 52.07,31.75 52.07,39.37 57.15,44.45
  Bottom 0.152: v38.1,36.83 ALM_VOL.3